# EAGLE design Elektroskate Teensy 20141205 (EAGLE 7.2.0)
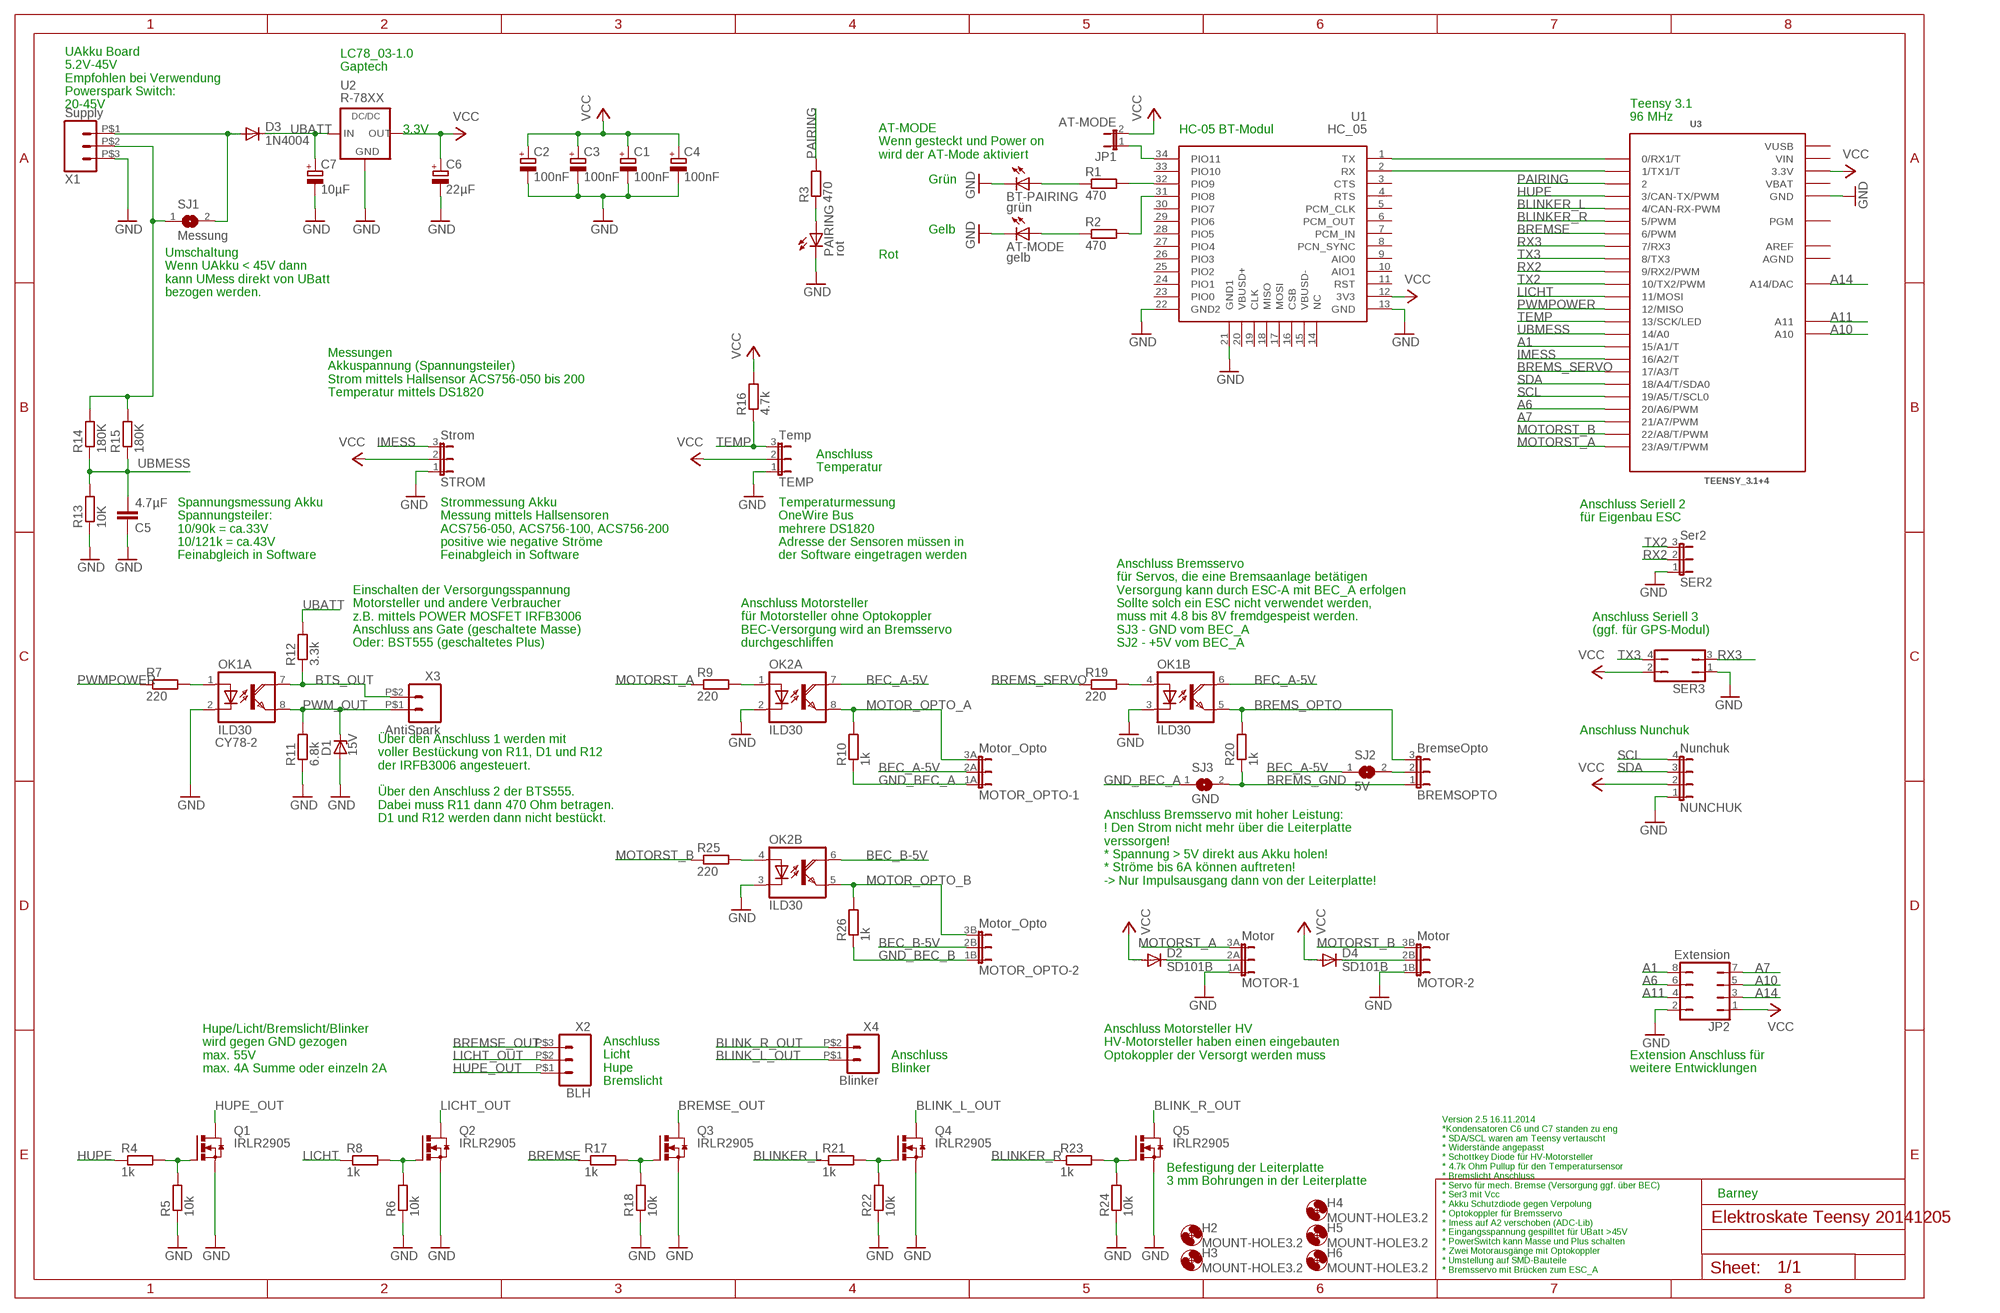
[diagram p0: schematic, sheet 1]

## Parts
AT-MODE  gelb  LEDSML0805  [SML0805]
BREMSOPTO  BremseOpto  JP2E  [JP2]
BT-PAIRING  grün  LEDSML0805  [SML0805]
C1  100nF  CPOL-EUB45181A  [B45181A]
C2  100nF  CPOL-EUB45181A  [B45181A]
C3  100nF  CPOL-EUB45181A  [B45181A]
C4  100nF  CPOL-EUB45181A  [B45181A]
C5  4.7µF  C-EUC1206  [C1206]
C6  22µF  CPOL-EUUD-4X5,8  [UD-4X5,8_NICHICON]
C7  10µF  CPOL-EUUD-6,3X8,8  [UD-6,3X5,8_NICHICON]
D1  15V  ZPD  [DO35Z10]
D2  SD101B  MBR0520LT  [SOD123]
D3  1N4004  [DO41-10]
D4  SD101B  MBR0520LT  [SOD123]
H2  MOUNT-HOLE3.2  [3,2]
H3  MOUNT-HOLE3.2  [3,2]
H4  MOUNT-HOLE3.2  [3,2]
H5  MOUNT-HOLE3.2  [3,2]
H6  MOUNT-HOLE3.2  [3,2]
JP1  AT-MODE  JP1E  [JP1]
JP2  Extension  JP4Q  [JP4Q]
MOTOR  Motor  JP3QE  [JP3Q]
MOTOR_OPTO  Motor_Opto  JP3QE  [JP3Q]
NUNCHUK  Nunchuk  JP4E  [JP4]
OK1  ILD30  [DIL08]
OK2  ILD30  [DIL08]
PAIRING  rot  LEDSML0805  [SML0805]
Q1  IRLR2905  [D-PAK_TO252AA]
Q2  IRLR2905  [D-PAK_TO252AA]
Q3  IRLR2905  [D-PAK_TO252AA]
Q4  IRLR2905  [D-PAK_TO252AA]
Q5  IRLR2905  [D-PAK_TO252AA]
R1  470  R-EU_R1206  [R1206]
R2  470  R-EU_R1206  [R1206]
R3  470  R-EU_R1206  [R1206]
R4  1k  R-EU_R1206  [R1206]
R5  10k  R-EU_R1206  [R1206]
R6  10k  R-EU_R1206  [R1206]
R7  220  R-EU_R1206  [R1206]
R8  1k  R-EU_R1206  [R1206]
R9  220  R-EU_R1206  [R1206]
R10  1k  R-EU_R1206  [R1206]
R11  6.8k  R-EU_R1206  [R1206]
R12  3.3k  R-EU_R1206  [R1206]
R13  10K  R-EU_R1206  [R1206]
R14  180K  R-EU_R1206  [R1206]
R15  180K  R-EU_R1206  [R1206]
R16  4.7k  R-EU_R1206  [R1206]
R17  1k  R-EU_R1206  [R1206]
R18  10k  R-EU_R1206  [R1206]
R19  220  R-EU_R1206  [R1206]
R20  1k  R-EU_R1206  [R1206]
R21  1k  R-EU_R1206  [R1206]
R22  10k  R-EU_R1206  [R1206]
R23  1k  R-EU_R1206  [R1206]
R24  10k  R-EU_R1206  [R1206]
R25  220  R-EU_R1206  [R1206]
R26  1k  R-EU_R1206  [R1206]
SER2  Ser2  JP2E  [JP2]
SER3  JP2Q  [JP2Q]
SJ1  Messung  SJ  [SJ]
SJ2  5V  SJ  [SJ]
SJ3  GND  SJ  [SJ]
STROM  Strom  JP2E  [JP2]
TEMP  Temp  JP2E  [JP2]
U1  HC_05  [BLUETOOTH_SMD]
U2  R-78XX  [R-78XX]
U3  TEENSY_3.1+4  [TEENSY_3.1+4]
X1  Supply  PSS254_3GEWINKELT  [03W]
X2  BLH  PSS254_3GEWINKELT  [03W]
X3  AntiSpark  PSS254_2GEWINKELT  [02W]
X4  Blinker  PSS254_2GEWINKELT  [02W]

## Nets
A1: JP2.8 U3.15/A1(15/A1/T)
A6: JP2.6 U3.20/A6(20/A6/PWM)
A7: JP2.7 U3.21/A7(21/A7/PWM)
A10: JP2.5 U3.A10
A11: JP2.4 U3.A11
A14: JP2.3 U3.A14(A14/DAC)
BEC_A-5V: MOTOR_OPTO.2A OK1.6(B:COL) OK2.7(A:COL) SJ2.1
BEC_B-5V: MOTOR_OPTO.2B OK2.6(B:COL)
BLINK_L_OUT: Q4.4(D) X4.P$1
BLINK_R_OUT [96mil]: Q5.4(D) X4.P$2
BLINKER_L: R21.1 U3.4(4/CAN-RX-PWM)
BLINKER_R: R23.1 U3.5(5/PWM)
BREMS_GND: BREMSOPTO.1 R20.1 SJ3.2
BREMS_OPTO: BREMSOPTO.3 OK1.5(B:EMI) R20.2
BREMS_SERVO: R19.1 U3.17/A3(17/A3/T)
BREMSE: R17.1 U3.6(6/PWM)
BREMSE_OUT: Q3.4(D) X2.P$3
BTS_OUT: OK1.7(A:COL) R12.1 X3.P$2
GND [24mil]: AT-MODE.C BT-PAIRING.C C1.- C2.- C3.- C4.- C5.1 C6.- C7.- D1.A JP2.2 MOTOR.1A MOTOR.1B NUNCHUK.1 OK1.2(A:C) OK1.3(B:C) OK2.2(A:C) OK2.3(B:C) PAIRING.C Q1.3(S) Q2.3(S) Q3.3(S) Q4.3(S) Q5.3(S) R5.1 R6.1 R11.1 R13.1 R18.1 R22.1 R24.1 SER2.1 SER3.1 STROM.1 TEMP.1 U1.13(GND) U1.21(GND1) U1.22(GND2) U2.2(GND) U3.GND U3.GND1(GND) X1.P$3
GND_BEC_A [24mil]: MOTOR_OPTO.1A R10.1 SJ3.1
GND_BEC_B: MOTOR_OPTO.1B R26.1
HUPE: R4.1 U3.3(3/CAN-TX/PWM)
HUPE_OUT: Q1.4(D) X2.P$1
IMESS: STROM.3 U3.16/A2(16/A2/T)
LICHT: R8.1 U3.11(11/MOSI)
LICHT_OUT: Q2.4(D) X2.P$2
MOTOR_OPTO_A: MOTOR_OPTO.3A OK2.8(A:EMI) R10.2
MOTOR_OPTO_B: MOTOR_OPTO.3B OK2.5(B:EMI) R26.2
MOTORST_A: MOTOR.3A R9.1 U3.23/A9(23/A9/T/PWM)
MOTORST_B: MOTOR.3B R25.1 U3.22/A8(22/A8/T/PWM)
N$1: U1.1(TX) U3.0(0/RX1/T)
N$2: U1.2(RX) U3.1(1/TX1/T)
N$3: BT-PAIRING.A R1.1
N$4: PAIRING.A R3.1
N$5: OK2.1(A:A) R9.2
N$6: R2.2 U1.31(PIO8)
N$7: AT-MODE.A R2.1
N$8: R1.2 U1.32(PIO9)
N$10: OK1.1(A:A) R7.2
N$11: D2.C MOTOR.2A
N$12: Q3.1(G) R17.2 R18.2
N$13 [48mil]: D3.A SJ1.2 X1.P$1
N$14: Q1.1(G) R4.2 R5.2
N$15: Q2.1(G) R6.2 R8.2
N$16: JP1.1 U1.34(PIO11)
N$17: OK1.4(B:A) R19.2
N$18: R14.2 R15.2 SJ1.1 X1.P$2
N$19: Q4.1(G) R21.2 R22.2
N$20: Q5.1(G) R23.2 R24.2
N$21: BREMSOPTO.2 SJ2.2
N$23: OK2.4(B:A) R25.2
N$24: D4.C MOTOR.2B
PAIRING: R3.2 U3.2
PWM_OUT: D1.C OK1.8(A:EMI) R11.2 X3.P$1
PWMPOWER: R7.1 U3.12(12/MISO)
RX2: SER2.2 U3.9(9/RX2/PWM)
RX3: SER3.3 U3.7(7/RX3)
SCL: NUNCHUK.4 U3.19/A5(19/A5/T/SCL0)
SDA: NUNCHUK.3 U3.18/A4(18/A4/T/SDA0)
TEMP: R16.1 TEMP.3 U3.13(13/SCK/LED)
TX2: SER2.3 U3.10(10/TX2/PWM)
TX3: SER3.4 U3.8(8/TX3)
UBATT [24mil]: C7.+ D3.C R12.2 U2.1(IN)
UBMESS: C5.2 R13.2 R14.1 R15.1 U3.14/A0
VCC [24mil]: C1.+ C2.+ C3.+ C4.+ C6.+ D2.A D4.A JP1.2 JP2.1 NUNCHUK.2 R16.2 SER3.2 STROM.2 TEMP.2 U1.12(3V3) U2.3(OUT) U3.3.3V U3.3.3V1(3.3V)
Unconnected: U1.3(CTS) U1.4(RTS) U1.5(PCM_CLK) U1.6(PCM_OUT) U1.7(PCM_IN) U1.8(PCN_SYNC) U1.9(AIO0) U1.10(AIO1) U1.11(RST) U1.14(NC) U1.15(VBUSD-) U1.16(CSB) U1.17(MOSI) U1.18(MISO) U1.19(CLK) U1.20(VBUSD+) U1.23(PIO0) U1.24(PIO1) U1.25(PIO2) U1.26(PIO3) U1.27(PIO4) U1.28(PIO5) U1.29(PIO6) U1.30(PIO7) U1.33(PIO10) U3.PGM

## Notes on the sheet
- LC78_03-1.0
  Gaptech
- UAkku Board
  5.2V-45V
  Empfohlen bei Verwendung
  Powerspark Switch:
  20-45V
- Teensy 3.1
  96 MHz
- HC-05 BT-Modul
- AT-MODE
  Wenn gesteckt und Power on
  wird der AT-Mode aktiviert
- Grün
- Gelb
- Rot
- Umschaltung
  Wenn UAkku < 45V dann 
  kann UMess direkt von UBatt 
  bezogen werden.
- Messungen
  Akkuspannung (Spannungsteiler)
  Strom mittels Hallsensor ACS756-050 bis 200
  Temperatur mittels DS1820
- Anschluss
  Temperatur
- Anschluss Seriell 2
  für Eigenbau ESC
- Spannungsmessung Akku
  Spannungsteiler:
  10/90k = ca.33V
  10/121k = ca.43V
  Feinabgleich in Software
- Strommessung Akku
  Messung mittels Hallsensoren
  ACS756-050, ACS756-100, ACS756-200  
  positive wie negative Ströme
  Feinabgleich in Software
- Temperaturmessung
  OneWire Bus
  mehrere DS1820
  Adresse der Sensoren müssen in
  der Software eingetragen werden
- Anschluss Seriell 3
  (ggf. für GPS-Modul)
- Einschalten der Versorgungsspannung
  Motorsteller und andere Verbraucher
  z.B. mittels POWER MOSFET IRFB3006
  Anschluss ans Gate (geschaltete Masse)
  Oder: BST555 (geschaltetes Plus)
- Anschluss Motorsteller
  für Motorsteller ohne Optokoppler
  BEC-Versorgung wird an Bremsservo
  durchgeschliffen
- Anschluss Bremsservo
  für Servos, die eine Bremsaanlage betätigen
  Versorgung kann durch ESC-A mit BEC_A erfolgen
  Sollte solch ein ESC nicht verwendet werden,
  muss mit 4.8 bis 8V fremdgespeist werden.
  SJ3 - GND vom BEC_A
  SJ2 - +5V vom BEC_A
- Anschluss Nunchuk
- Über den Anschluss 1 werden mit 
  voller Bestückung von R11, D1 und R12
  der IRFB3006 angesteuert.
  
  Über den Anschluss 2 der BTS555. 
  Dabei muss R11 dann 470 Ohm betragen. 
  D1 und R12 werden dann nicht bestückt.
- Anschluss Bremsservo mit hoher Leistung:
  ! Den Strom nicht mehr über die Leiterplatte
  verssorgen!
  * Spannung > 5V direkt aus Akku holen!
  * Ströme bis 6A können auftreten!
  -> Nur Impulsausgang dann von der Leiterplatte!
- Hupe/Licht/Bremslicht/Blinker
  wird gegen GND gezogen
  max. 55V
  max. 4A Summe oder einzeln 2A
- Anschluss 
  Blinker
- Anschluss Motorsteller HV
  HV-Motorsteller haben einen eingebauten
  Optokoppler der Versorgt werden muss
- Extension Anschluss für
  weitere Entwicklungen
- Anschluss 
  Licht
  Hupe
  Bremslicht
- Befestigung der Leiterplatte
  3 mm Bohrungen in der Leiterplatte
- Barney
- Version 2.5 16.11.2014
  *Kondensatoren C6 und C7 standen zu eng
  * SDA/SCL waren am Teensy vertauscht
  * Widerstände angepasst
  * Schottkey Diode für HV-Motorsteller
  * 4.7k Ohm Pullup für den Temperatursensor
  * Bremslicht Anschluss
  * Servo für mech. Bremse (Versorgung ggf. über BEC)
  * Ser3 mit Vcc
  * Akku Schutzdiode gegen Verpolung
  * Optokoppler für Bremsservo
  * Imess auf A2 verschoben (ADC-Lib)
  * Eingangsspannung gespilltet für UBatt >45V
  * PowerSwitch kann Masse und Plus schalten
  * Zwei Motorausgänge mit Optokoppler
  * Umstellung auf SMD-Bauteile
  * Bremsservo mit Brücken zum ESC_A

## Power pins joined to a net without a drawn wire
AGND: U3.AGND
AREF: U3.AREF
VBAT: U3.VBAT
VIN: U3.VIN
VUSB: U3.VUSB

## Library data of the parts
AT-MODE BT-PAIRING PAIRING = led:LED: LED OSRAM: - CHIPLED LG R971, LG N971, LY N971, LG Q971, LY Q971, LO R971, LY R971 LH N974, LH R974 LS Q976, LO Q976, LY Q976 LO Q996 - Hyper CHIPLED LW Q18S LB Q993, LB Q99A, LB R99A - SideLED LS A670, LO A670, LY A670, LG A670, LP A670 LB A673, LV A673, LT A673, LW A673 LH A674 LY A675 LS A676, LA A676, LO A676, LY A676, LW A676 LS A679, LY A679, LG A679 - Hyper Micro SIDELED® LS Y876, LA Y876, LO Y876, LY Y876 LT Y87S - SmartLED LW L88C, LW L88S LB L89C, LB L89S, LG L890 LS L89K, LO L89K, LY L89K LS L896, LA L896, LO L896, LY L896 - TOPLED LS T670, LO T670, LY T670, LG T670, LP T670 LSG T670, LSP T670, LSY T670, LOP T670, LYG T670 LG T671, LOG T671, LSG T671 LB T673, LV T673, LT T673, LW T673 LH T674 LS T676, LA T676, LO T676, LY T676, LB T676, LH T676, LSB T676, LW T676 LB T67C, LV T67C, LT T67C, LS T67K, LO T67K, LY T67K, LW E67C LS E67B, LA E67B, LO E67B, LY E67B, LB E67C, LV E67C, LT E67C LW T67C LS T679, LY T679, LG T679 LS T770, LO T770, LY T770, LG T770, LP T770 LB T773, LV T773, LT T773, LW T773 LH T774 LS E675, LA E675, LY E675, LS T675 LS T776, LA T776, LO T776, LY T776, LB T776 LHGB T686 LT T68C, LB T68C - Hyper Mini TOPLED® LB M676 - Mini TOPLED Santana® LG M470 LS M47K, LO M47K, LY M47K Source: http://www.osram.convergy.de LUXEON: - LUMILED® LXK2-PW12-R00, LXK2-PW12-S00, LXK2-PW14-U00, LXK2-PW14-V00 LXK2-PM12-R00, LXK2-PM12-S00, LXK2-PM14-U00 LXK2-PE12-Q00, LXK2-PE12-R00, LXK2-PE12-S00, LXK2-PE14-T00, LXK2-PE14-U00 LXK2-PB12-K00, LXK2-PB12-L00, LXK2-PB12-M00, LXK2-PB14-N00, LXK2-PB14-P00, LXK2-PB14-Q00 LXK2-PR12-L00, LXK2-PR12-M00, LXK2-PR14-Q00, LXK2-PR14-R00 LXK2-PD12-Q00, LXK2-PD12-R00, LXK2-PD12-S00 LXK2-PH12-R00, LXK2-PH12-S00 LXK2-PL12-P00, LXK2-PL12-Q00, LXK2-PL12-R00 Source: www.luxeon.com KINGBRIGHT: KA-3528ASYC Source: www.kingbright.com
BREMSOPTO SER2 STROM TEMP = jumper:JP2E: JUMPER
C1-C4 C6 C7 = rcl:CPOL-EU: POLARIZED CAPACITOR, European symbol
C5 = rcl:C-EU: CAPACITOR, European symbol
D1 = diode:ZPD: Z DIODE 500 mW
D2 D4 = diode:MBR0520LT: SCHOTTKY BARRIER RECTIFIER Source: http://onsemi.com .. MBR0520LT1-D.pdf
D3 = diode:1N4004: DIODE general purpose rectifier, 1 A
H2-H6 = holes:MOUNT-HOLE: MOUNTING HOLE with drill center marker
JP1 = jumper:JP1E: JUMPER
JP2 = jumper:JP4Q: JUMPER
MOTOR MOTOR_OPTO = connector:JP3QE: JUMPER
NUNCHUK = jumper:JP4E: JUMPER
OK1 OK2 = optocoupler:ILD30: SIEMENS OPTO COUPLER; MF: VISHAY/TELEFUNKEN; MPN: ILD30; OC_FARNELL: 1612448; OC_NEWARK: 58K1668
Q1-Q5 = International Rectifier:IRLR2905: SMPS MOSFET HEXFET® Power MOSFET Source: http://www.irf.com/product-info/datasheets/data/irf3704.pdf
R1-R26 = rcl:R-EU_: RESISTOR, European symbol
SER3 = jumper:JP2Q: JUMPER
SJ1-SJ3 = jumper:SJ: SMD solder JUMPER
U1 = Bluetooth HC-05:HC_05: HC-05 Bluetooth Module
U2 = recom-intl:R-78XX: DC-DC CONVERTER R-78xx-0.5 Series; LC78_03-10: Gaptech; SPANNUNG: 3.3V
U3 = Teensy_3_Series_Board_v1.0:TEENSY_3.1+4: Footprint for Teensy 3.1 board using all through-holes, i.e. the entire perimeter plus the 4 through-holes inboard (A10,A11,AREF, VUSB)
X1 X2 = con-pss254_reichelt:PSS254_3
X3 X4 = con-pss254_reichelt:PSS254_2

## Net classes
0 default: width 0.305 mm, clearance 0.205 mm
1 24mil: width 0.61 mm, clearance 0.205 mm to class 0, clearance 0.205 mm
2 48mil: width 1.219 mm, clearance 0.205 mm to class 0, clearance 0.205 mm to class 1, clearance 0.205 mm
3 96mil: width 2.438 mm

## Board
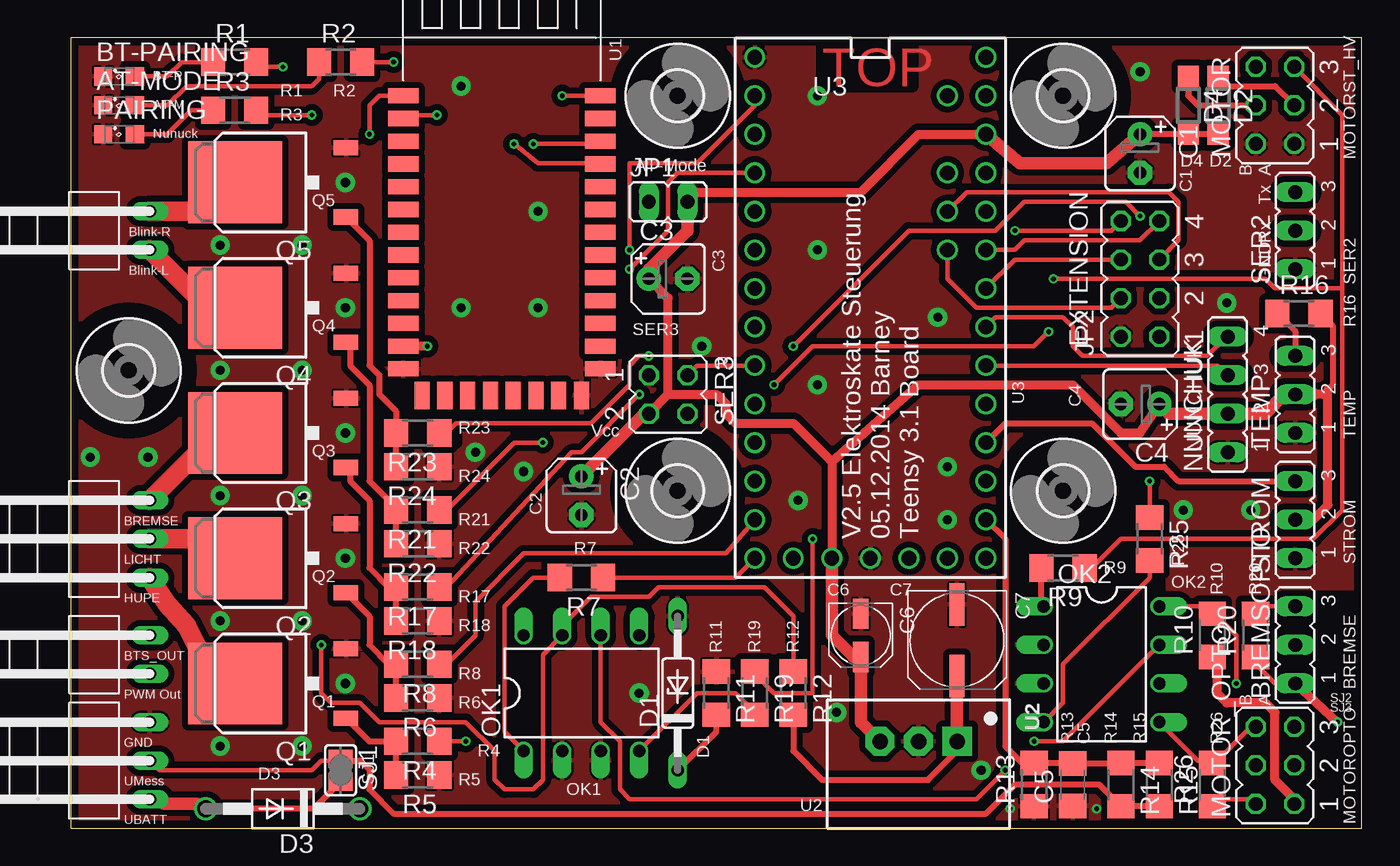
[diagram p1: board, top side]
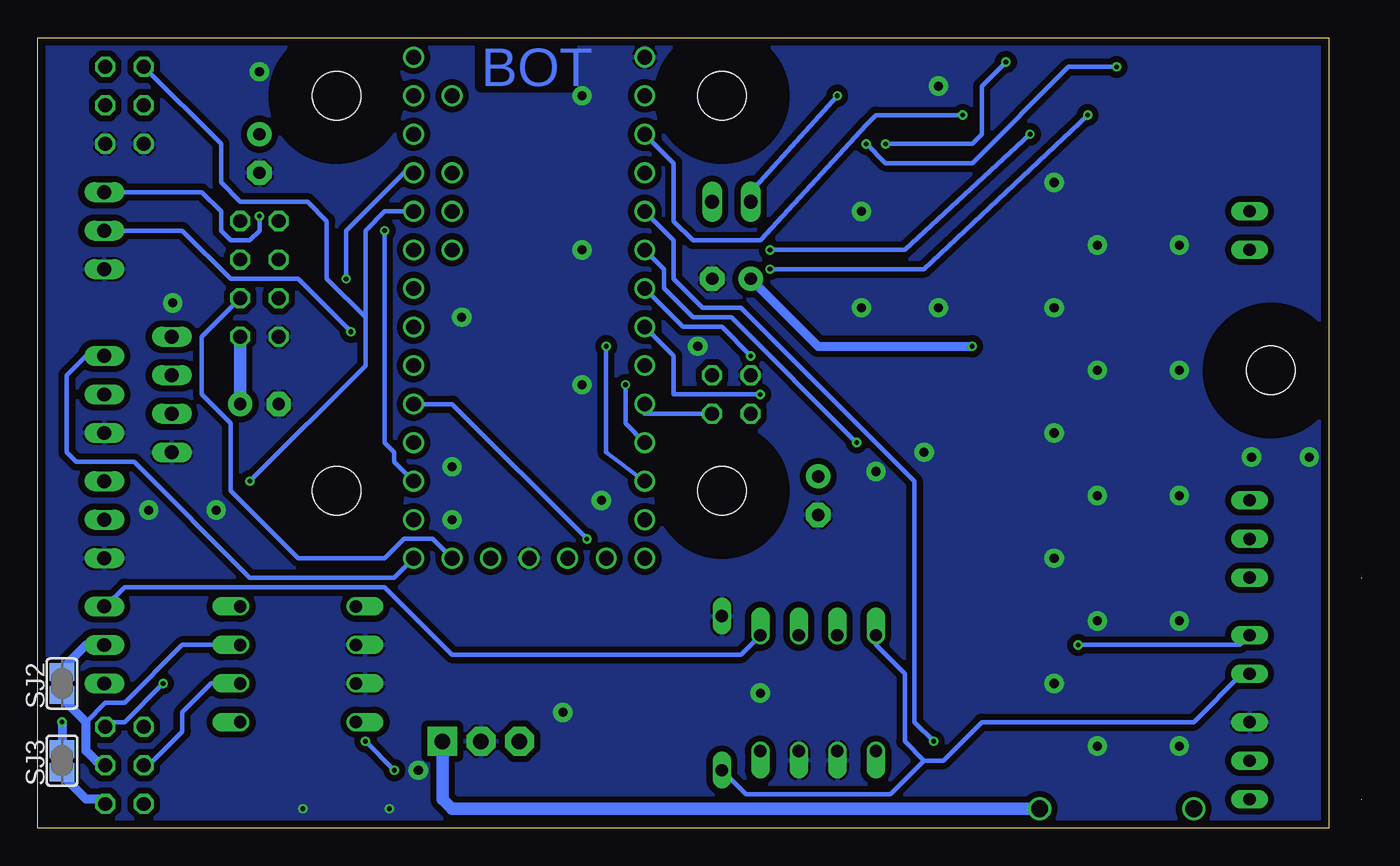
[diagram p2: board, bottom side, seen from below]

Size 85.09 x 52.07 mm. Coordinates in mm from the lower left corner, seen from the top.
Outline: 0,0 85.09,0 85.09,52.07 0,52.07 0,0
Copper layers (1*16): Top 0.035mm / dielectric 1.5mm / Bottom 0.035mm
Design rules "multi-cb_035um-cu-Fischer-Leiterplatten 20141223": minimum track width 6mil, minimum drill 12mil, track to track 6mil, track to pad 6mil, pad to pad 6mil, via to via 6mil, smd to smd 6mil, copper to edge 20mil, drill to drill 8mil, minimum pad ring 8mil, minimum via ring 6mil, stop-mask expansion 6mil, vias tented up to drill 0mil, thermal gap 6mil
tRestrict: area 81.9,-0.6 to 85.1,15.2; area 20.3,25.4 to 25.4,29.2; area 62.9,5.1 to 71.8,18.4

### Footprints (pad centres in the part's own frame; a part is rotated, then mirrored left to right if it is on the bottom)
SML0805 = smd 1.2 x 1.2: A 1.05,0; C -1.05,0
JP2 = drill 0.914 long: 1 -2.54,0; 2 0,0; 3 2.54,0
B45181A = drill 0.813 pad 1.6: + -1.27,0 | drill 0.813 pad 1.6 octagon: - 1.27,0
C1206 = smd 1.6 x 1.8: 1 -1.4,0; 2 1.4,0
UD-4X5,8_NICHICON = smd 2 x 1: + 1.425,0; - -1.425,0
UD-6,3X5,8_NICHICON = smd 2.8 x 1: + 2.35,0; - -2.35,0
DO35Z10 = drill 0.813 long: A 5.08,0; C -5.08,0
SOD123 = smd 1.4 x 1.4: A 1.9,0; C -1.9,0
DO41-10 = drill 1.118: A 5.08,0; C -5.08,0
3,2 = hole 3.2: 0,0
JP1 = drill 0.914 long: 1 0,-1.27; 2 0,1.27
JP4Q = drill 0.914 octagon: 1 -3.81,-1.27; 2 -3.81,1.27; 3 -1.27,-1.27; 4 -1.27,1.27; 5 1.27,-1.27; 6 1.27,1.27; 7 3.81,-1.27; 8 3.81,1.27
JP3Q = drill 0.914 octagon: 1A -2.54,-1.27; 1B -2.54,1.27; 2A 0,-1.27; 2B 0,1.27; 3A 2.54,-1.27; 3B 2.54,1.27
JP4 = drill 0.914 long: 1 -3.81,0; 2 -1.27,0; 3 1.27,0; 4 3.81,0
DIL08 = drill 0.813 offset: 1 -3.81,-3.81; 2 -1.27,-3.81; 3 1.27,-3.81; 4 3.81,-3.81; 5 3.81,3.81; 6 1.27,3.81; 7 -1.27,3.81; 8 -3.81,3.81
D-PAK_TO252AA = smd 1 x 1.6: 1 -2.28,-4.8; 3 2.28,-4.8 | smd 5.4 x 6.2: 4 0,2.5
R1206 = smd 1.6 x 1.803: 1 -1.422,0; 2 1.422,0
JP2Q = drill 0.914 octagon: 1 -1.27,-1.27; 2 1.27,-1.27; 3 -1.27,1.27; 4 1.27,1.27
SJ = smd 1.168 x 1.6: 1 -0.762,0; 2 0.762,0
BLUETOOTH_SMD = smd 2 x 1: 1 -6.35,3.81; 2 -6.35,2.31; 3 -6.35,0.81; 4 -6.35,-0.69; 5 -6.35,-2.19; 6 -6.35,-3.69; 7 -6.35,-5.19; 8 -6.35,-6.69; 9 -6.35,-8.19; 10 -6.35,-9.69; 11 -6.35,-11.19; 12 -6.35,-12.69; 13 -6.35,-14.19; 22 6.65,-14.19; 23 6.65,-12.69; 24 6.65,-11.19; 25 6.65,-9.69; 26 6.65,-8.19; 27 6.65,-6.69; 28 6.65,-5.19; 29 6.65,-3.69; 30 6.65,-2.19; 31 6.65,-0.69; 32 6.65,0.81; 33 6.65,2.31; 34 6.65,3.81 | smd 1 x 1.8: 14 -5.1,-15.94; 15 -3.6,-15.94; 16 -2.1,-15.94; 17 -0.6,-15.94; 18 0.9,-15.94; 19 2.4,-15.94; 20 3.9,-15.94; 21 5.4,-15.94
R-78XX = drill 1.016 pad 1.93 square: 1 -2.54,0 | drill 1.016 pad 1.93 octagon: 2 0,0; 3 2.54,0
TEENSY_3.1+4 = drill 0.965: 0 -7.62,15.24; 1 -7.62,12.7; 2 -7.62,10.16; 3 -7.62,7.62; 3.3V 7.62,12.7; 3.3V1 -2.54,-15.24; 4 -7.62,5.08; 5 -7.62,2.54; 6 -7.62,0; 7 -7.62,-2.54; 8 -7.62,-5.08; 9 -7.62,-7.62; 10 -7.62,-10.16; 11 -7.62,-12.7; 12 -7.62,-15.24; 13 7.62,-15.24; 14/A0 7.62,-12.7; 15/A1 7.62,-10.16; 16/A2 7.62,-7.62; 17/A3 7.62,-5.08; 18/A4 7.62,-2.54; 19/A5 7.62,0; 20/A6 7.62,2.54; 21/A7 7.62,5.08; 22/A8 7.62,7.62; 23/A9 7.62,10.16; A10 5.08,7.62; A11 5.08,5.08; A14 5.08,-15.24; AGND 7.62,15.24; AREF 5.08,10.16; GND -7.62,17.78; GND1 0,-15.24; PGM 2.54,-15.24; VBAT -5.08,-15.24; VIN 7.62,17.78; VUSB 5.08,15.24
03W = drill 0.8 long: P$1 1.27,-2.032; P$2 3.81,-2.032; P$3 6.35,-2.032
02W = drill 0.8 long: P$1 1.27,-2.032; P$2 3.81,-2.032

### Placement (x,y rotation side)
AT-MODE  3.17,47.62 0 top
BREMSOPTO  80.71,12.06 90 top
BT-PAIRING  3.17,49.53 0 top
C1  70.48,44.45 270 top
C2  33.66,21.91 270 top
C3  39.37,36.2 0 top
C4  70.48,27.94 180 top
C5  66.04,2.86 90 top
C6  52.07,12.7 270 top
C7  58.42,12.38 270 top
D1  40.01,8.89 90 top
D2  75.63,47.62 270 top
D3  13.97,1.27 180 top
D4  73.66,47.62 270 top
H2  40.01,48.26 0 top
H3  3.81,30.16 0 top
H4  65.41,22.23 0 top
H5  40.01,22.23 0 top
H6  65.41,48.26 0 top
JP1  39.37,41.27 270 top
JP2  70.48,36.2 90 top
MOTOR  79.38,47.62 90 top
MOTOR_OPTO  79.38,4.13 90 top
NUNCHUK  76.26,28.57 90 top
OK1  33.66,8.89 0 top
OK2  67.94,10.79 270 top
PAIRING  3.17,45.72 0 top
Q1  13.34,9.53 90 top
Q2  13.34,17.78 90 top
Q3  13.34,26.04 90 top
Q4  13.34,34.29 90 top
Q5  13.34,42.55 90 top
R1  10.79,50.48 0 top
R2  17.78,50.48 0 top
R3  10.79,47.31 0 top
R4  22.86,5.71 180 top
R5  22.86,3.49 180 top
R6  22.86,8.57 180 top
R7  33.66,16.51 180 top
R8  22.86,10.79 180 top
R9  65.41,17.14 180 top
R10  75.25,12.7 90 top
R11  42.55,8.89 270 top
R12  47.62,8.89 270 top
R13  63.5,2.86 90 top
R14  69.22,2.86 270 top
R15  71.75,2.86 270 top
R16  80.96,33.91 0 top
R17  22.86,15.88 180 top
R18  22.86,13.65 180 top
R19  45.09,8.89 270 top
R20  78.11,12.7 90 top
R21  22.86,20.95 180 top
R22  22.86,18.73 180 top
R23  22.86,26.04 180 top
R24  22.86,23.81 180 top
R25  71.12,19.05 270 top
R26  75.25,2.86 90 top
SER2  80.71,39.37 90 top
SER3  39.37,28.57 270 top
SJ1  17.78,3.81 270 top
SJ2  83.5,9.53 90 bottom
SJ3  83.5,4.45 90 bottom
STROM  80.71,20.32 90 top
TEMP  80.71,28.57 90 top
U1  28.26,44.45 0 top
U2  55.88,5.71 180 top
U3  52.7,33.02 0 top
X1  3.17,0.64 90 top
X2  3.17,15.24 90 top
X3  3.17,8.89 90 top
X4  3.17,36.83 90 top

### Tracks (layer width: path | path; a pad name or v marks a point on that pad's centre or on a via)
A1  (via drill 0.3)
  Top 0.305: JP2.8 68.58,39.37 v62.23,39.37
  Bottom 0.305: v62.23,39.37 62.23,25.4 61.59,24.77 61.59,24.13 U3.15/A1
A6
  Top 0.305: JP2.6 62.23,37.47 U3.20/A6
A7
  Top 0.305: JP2.7 70.48,38.73 62.87,38.73 62.23,38.1 U3.21/A7
A10
  Top 0.305: JP2.5 73.03,38.73 73.03,41.27 72.39,41.91 59.05,41.91 U3.A10
A11
  Top 0.305: JP2.4 68.58,34.29 59.69,34.29 57.78,36.2 U3.A11
A14
  Bottom 0.305: JP2.3 74.3,32.38 74.3,28.57 72.39,26.67 72.39,22.23 67.94,17.78 62.23,17.78 60.96,19.05 59.05,19.05 U3.A14
BEC_A-5V  (via drill 0.3)
  Top 0.305: OK1.6 34.92,6.99 36.2,5.71 36.2,2.54 36.83,1.91 59.69,1.91 v61.59,3.81 | v63.5,5.71 65.41,5.71 OK2.7
  Bottom 0.305: 83.19,8.26 SJ2.1 | 80.64,3.81 MOTOR_OPTO.2A | 81.92,6.99 80.64,8.26 79.38,8.26 75.56,12.06 OK2.7 | v61.59,3.81 v63.5,5.71
  Bottom 0.61: 83.19,8.26 81.92,6.99 81.92,5.08 80.64,3.81
BEC_B-5V
  Bottom 0.305: OK2.6 73.66,9.53 75.56,7.62 75.56,6.35 78.11,3.81 MOTOR_OPTO.2B
BLINK_L_OUT
  Top 1.27: X4.P$1 9.02,34.29 Q4.4
BLINK_R_OUT
  Top 1.27: X4.P$2 9.53,40.64 10.84,41.95 Q5.4
BLINKER_L  (via drill 0.3)
  Top 0.305: v31.11,25.4 29.21,25.4 24.77,20.95 R21.1
  Bottom 0.305: v31.11,25.4 39.37,33.66 41.91,33.66 43.81,35.56 43.81,36.83 U3.4
BLINKER_R  (via drill 0.3)
  Top 0.305: v38.1,31.11 37.47,31.11 36.83,30.48 36.83,29.21 34.29,26.67 25.4,26.67 24.77,26.04 R23.1
  Bottom 0.305: v38.1,31.11 40.01,33.02 42.55,33.02 U3.5
BREMS_GND  (via drill 0.3)
  Top 0.305: BREMSOPTO.1 79.38,9.53 78.11,10.79 R20.1
  Top 0.61: BREMSOPTO.1 v83.5,6.99
  Bottom 0.61: v83.5,6.99 SJ3.2
BREMS_OPTO
  Top 0.305: BREMSOPTO.3 78.11,14.61 R20.2
  Bottom 0.305: OK1.5 38.73,11.43 57.78,11.43 62.23,15.88 79.38,15.88 80.64,14.61 BREMSOPTO.3
BREMS_SERVO  (via drill 0.3)
  Top 0.305: v48.9,19.05 48.9,8.89 46.35,8.89 45.09,10.16 R19.1
  Bottom 0.305: v48.9,19.05 57.78,27.94 U3.17/A3
BREMSE  (via drill 0.3)
  Top 0.305: v37.47,28.57 33.66,24.77 33.02,24.77 24.77,15.88 R17.1
  Bottom 0.305: v37.47,28.57 43.18,28.57 43.18,31.11 U3.6
BREMSE_OUT
  Top 1.27: X2.P$3 9.65,26.04 Q3.4
BTS_OUT  (via drill 0.3)
  Top 0.305: 47.62,10.79 R12.1 47.62,13.97 45.72,15.88 38.73,15.88 38.1,15.24 34.29,15.24 32.38,13.34 OK1.7 31.11,11.43 31.11,3.17 30.48,2.54 28.57,2.54 27.94,3.17 27.94,5.08 26.04,6.99 20.32,6.99 19.05,8.26 17.14,8.26 16.51,8.89 v16.51,12.06
  Bottom 0.305: v16.51,12.06 5.84,12.06 X3.P$2
GND  (via drill 0.3, 0.6 pad 1.27)
  other vias: 18.1,9.53 15.24,21.91 9.84,21.91 18.1,17.78 18.1,26.04 15.24,30.16 9.84,30.16 15.24,38.42 9.84,38.42 18.1,42.55 18.1,34.29 25.72,34.29 30.8,34.29 49.21,48.26 73.34,20.95 50.48,7.62 9.84,5.4 15.24,5.4 9.84,13.65 15.24,13.65 37.47,8.89 29.84,23.5 1.27,24.45 5.08,24.45 77.79,20.95 41.59,31.75 26.67,24.77 76.2,34.61 49.21,38.1 49.21,29.21 47.94,21.59 57.15,33.66 57.78,23.81 25.72,48.9 30.8,40.64 70.48,49.85 61.91,1.27 67.63,1.27 60.01,3.81 57.78,20.32
  pour Top (isolate 0.406, rank 2): 0,0 0,52.07 85.22,52.07 85.22,0
  pour Bottom (isolate 0.406, rank 2): 0,0 0,52.07 85.22,52.07 85.22,0
GND_BEC_A
  Top 0.61: R10.1 75.56,10.79 75.56,8.89 76.2,8.26 78.74,8.26 79.38,7.62 79.38,3.17 80.64,1.91 MOTOR_OPTO.1A
  Bottom 0.61: SJ3.1 83.19,3.17 81.92,1.91 80.64,1.91 MOTOR_OPTO.1A
GND_BEC_B
  Top 0.305: R26.1 75.56,1.91 78.11,1.91 MOTOR_OPTO.1B
HUPE  (via drill 0.3)
  Top 0.305: v26.04,5.71 R4.1
  Bottom 0.305: v26.04,5.71 27.3,6.99 27.3,22.86 38.73,34.29 41.27,34.29 43.18,36.2 43.18,38.73 U3.3
HUPE_OUT
  Top 1.27: X2.P$1 6.35,14.73 7.62,13.34 9.53,9.53 Q1.4
IMESS
  Top 0.406: U3.16/A2 61.59,26.67 67.31,26.67 70.17,23.81 72.07,23.81 73.03,22.86 STROM.3
LICHT
  Top 0.305: U3.11 43.18,18.1 29.84,18.1 26.67,14.92 26.67,12.7 24.77,10.79 R8.1
LICHT_OUT
  Top 1.27: X2.P$2 10.29,19.05 10.79,18.41 10.84,18.38 Q2.4
MOTOR_OPTO_A  (via drill 0.3)
  Top 0.305: OK2.8 74.93,14.61 R10.2 75.56,13.97 76.83,12.7 v76.83,9.53
  Bottom 0.305: v76.83,9.53 79.38,6.99 80.64,6.99 MOTOR_OPTO.3A
MOTOR_OPTO_B
  Top 0.305: MOTOR_OPTO.3B 78.11,6.35 77.47,6.35 75.56,4.45 R26.2 74.93,4.45 74.3,4.45 OK2.5
MOTORST_A  (via drill 0.3)
  Top 0.305: 83.82,35.56 83.82,46.99 MOTOR.3A | 83.82,35.56 83.82,20.95 81.92,19.05 69.22,19.05 67.31,17.14 R9.1 | v64.77,36.2 78.74,36.2 79.38,35.56 83.82,35.56
  Bottom 0.305: U3.23/A9 60.96,43.18 64.77,39.37 v64.77,36.2
MOTORST_B  (via drill 0.3)
  Top 0.305: v71.12,22.86 R25.1
  Bottom 0.305: v71.12,22.86 63.5,30.48 63.5,33.66 | 63.5,33.66 63.5,39.37 62.23,40.64 U3.22/A8 | MOTOR.3B 73.03,45.09 73.03,42.55 71.75,41.27 67.31,41.27 66.04,40.01 66.04,36.2 63.5,33.66
N$1  (via drill 0.3)
  Top 0.305: U1.1 20.32,48.26 19.68,47.62 v19.68,45.72 | v36.83,38.1 36.83,43.81 41.27,43.81 45.09,47.62 U3.0
  Bottom 0.305: v19.68,45.72 27.94,38.1 v36.83,38.1
N$2  (via drill 0.3)
  Top 0.305: v24.13,46.99 22.23,46.99 U1.2
  Bottom 0.305: v24.13,46.99 29.84,46.99 30.48,46.35 37.47,38.73 41.91,38.73 43.18,40.01 43.18,43.81 U3.1
N$3
  Top 0.305: BT-PAIRING.A 6.35,49.53 7.3,50.48 R1.1
N$4
  Top 0.305: PAIRING.A 6.35,45.72 7.94,47.31 R3.1
N$5
  Top 0.406: OK2.1 63.98,14.76 R9.2
N$6  (via drill 0.3)
  Top 0.305: v21.27,50.48 R2.2 | v29.21,45.09 30.8,43.81 34.29,43.81 U1.31
  Bottom 0.305: v29.21,45.09 23.5,45.09 22.86,45.72 22.86,48.9 v21.27,50.48
N$7
  Top 0.305: AT-MODE.A 6.35,47.62 7.62,48.9 15.88,48.9 16.36,49.38 R2.1
N$8  (via drill 0.3)
  Top 0.305: v30.48,45.09 34.29,45.09 U1.32 | v13.97,50.16 12.7,50.16 R1.2
  Bottom 0.305: v13.97,50.16 17.14,50.16 23.5,43.81 29.21,43.81 v30.48,45.09
N$10
  Top 0.305: OK1.1 28.57,6.35 28.57,14.61 30.48,16.51 R7.2
N$11
  Top 0.406: D2.C 76.26,48.9 79.38,48.9 MOTOR.2A
N$12
  Top 0.406: R18.2 R17.2 20.95,15.88 19.68,17.14 19.68,21.57 18.41,22.86 18.41,23.75 Q3.1
N$13
  Top 0.406: SJ1.2 16,1.27 D3.A
  Top 0.813: X1.P$1 6.16,1.59 8.26,1.59 D3.A
N$14
  Top 0.406: Q1.1 19.66,5.71 R4.2 R5.2
N$15
  Top 0.406: R6.2 R8.2 20.95,10.79 19.68,12.06 19.68,13.95 Q2.1
N$16  (via drill 0.3)
  Top 0.305: v32.38,48.26 U1.34
  Bottom 0.305: v32.38,48.26 38.1,41.91 JP1.1
N$17
  Top 0.305: OK1.4 41.27,8.89 43.81,8.89 45.09,7.62 R19.2
N$18
  Top 0.305: X1.P$2 5.84,3.81 15.88,3.81 16.51,4.45 17.65,4.45 SJ1.1
  Top 0.406: R15.2 R14.2 67.79,2.86 62.23,2.86 60.33,0.95 21.27,0.95 19.68,2.54 19.68,3.81 19.05,4.45 17.91,4.45 SJ1.1
N$19
  Top 0.406: R22.2 R21.2 21.44,21.11 19.68,22.86 19.68,29.19 18.41,30.48 18.41,32.01 Q4.1
N$20
  Top 0.406: R24.2 R23.2 21.44,27.46 20.32,28.57 20.32,29.84 19.68,30.48 19.68,38.72 Q5.1
N$21
  Bottom 0.305: 83.19,10.79 SJ2.2
  Bottom 0.61: 83.19,10.79 81.92,12.06 BREMSOPTO.2
N$23
  Top 0.305: R25.2 71.12,16.51 65.41,10.79 65.41,8.26 OK2.4
N$24
  Top 0.406: D4.C 73.66,48.26 74.3,47.62 MOTOR.2B
PAIRING  (via drill 0.3)
  Top 0.305: v15.88,46.99 12.7,46.99 R3.2 | v36.83,36.83 39.37,39.37 39.37,42.55 40.01,43.18 U3.2
  Bottom 0.305: v15.88,46.99 26.67,36.83 v36.83,36.83
PWM_OUT
  Top 0.406: D1.C 42.55,6.35 R11.2
  Bottom 0.305: 26.67,4.45 27.94,5.71 27.94,10.16 29.84,12.06 OK1.8 | 26.67,4.45 25.4,4.45 22.86,6.99 8.89,6.99 5.71,10.16 X3.P$1 | D1.C 38.42,2.22 28.89,2.22 26.67,4.45
PWMPOWER
  Top 0.305: R7.1 43.81,16.51 U3.12
RX2  (via drill 0.3)
  Top 0.305: v64.45,32.7 63.5,31.75 48.9,31.75 v46.35,29.21
  Bottom 0.305: v64.45,32.7 67.94,36.2 72.39,36.2 75.56,39.37 SER2.2 | v46.35,29.21 46.35,26.67 U3.9
RX3
  Top 0.305: SER3.3 41.27,30.48 U3.7
SCL
  Top 0.305: U3.19/A5 60.96,33.66 65.41,33.66 66.04,33.02 66.04,31.75 66.67,31.11 74.93,31.11 76.2,32.38 NUNCHUK.4
SDA
  Top 0.305: U3.18/A4 75.56,30.48 76.2,29.84 NUNCHUK.3
TEMP
  Top 0.406: R16.1 80.71,32.74 TEMP.3
  Bottom 0.305: U3.13 61.59,16.51 71.12,16.51 78.74,24.13 82.55,24.13 83.19,24.77 83.19,29.84 81.92,31.11 TEMP.3
TX2  (via drill 0.3)
  Top 0.305: v70.48,40.32 69.53,41.27 62.87,41.27 60.96,39.37 55.24,39.37 v47.62,31.75
  Bottom 0.305: SER2.3 74.3,41.91 73.03,40.64 73.03,39.37 72.39,38.73 71.12,38.73 70.48,39.37 v70.48,40.32 | v47.62,31.75 47.62,24.77 U3.10
TX3
  Bottom 0.305: SER3.4 45.09,27.3 U3.8
UBATT
  Top 0.406: R12.2 47.62,5.08 49.53,3.17 56.52,3.17 58.42,5.08 U2.1
  Top 0.813: C7.+ U2.1
  Bottom 0.813: U2.1 58.42,1.91 57.78,1.27 D3.C
UBMESS
  Top 0.406: R15.1 R14.1 69.22,4.26 C5.2 65.89,4.28 R13.2 62.71,4.28 61.59,5.4 61.59,19.05 U3.14/A0
VCC  (via drill 0.3)
  Top 0.406: R16.2 83.19,33.11 83.19,29.21 82.87,28.89 82.55,28.57 | D2.A D4.A C1.+
  Top 0.61: 82.55,28.57 81.92,28.57 | JP1.2 41.27,41.91 52.07,41.91 55.88,45.72 U3.3.3V | SER3.2 39.37,28.57 | 39.37,28.57 39.37,34.92 C3.+ | 39.37,28.57 42.55,28.57 43.18,27.94 43.18,27.3 43.81,26.67 47.62,26.67 50.16,24.13 | 50.16,24.13 U3.3.3V1 | C4.+ 70.48,26.04 69.22,26.04 66.04,29.21 55.88,29.21 50.16,24.13 | v23.5,31.75 22.23,31.75 U1.12 | STROM.2 81.92,20.32 82.87,21.27 82.87,28.89
  Top 0.813: U2.3 52.07,6.99 C6.+ 51.59,11.28 50.16,12.7 U3.3.3V1 | C4.+ 72.39,27.3 NUNCHUK.2 78.74,27.3 80.01,28.57 TEMP.2 81.92,28.57 | C1.+ 68.26,43.81 62.55,43.81 U3.3.3V | JP1.2 40.64,39.37 38.1,36.83 C3.+ | C2.+ 37.78,27.3 SER3.2
  Bottom 0.61: C3.+ 33.66,31.75 v23.5,31.75
  Bottom 0.813: JP2.1 C4.+

### Text on the board
Top: TOP
Bottom: BOT
_tNames: U1 | BT-P | R1 | R2 | AT-M | R3 | Nunuck | AT-Mode | D4 | D2 | MOTORST_HV | B | A | C1 | Q5 | Tx | Blink-R | Rx | C3 | Blink-L | GND | SER2 | Q4 | SER3 | R16 | EXTENSION | R | C4 | U3 | T | R23 | Vcc | TEMP | NUNCHUK | Q3 | R24 | C2 | BREMSE | R21 | V2.5 Elektroskate Steuerung / 05.12.2014 Barney / Teensy 3.1 Board | R22 | R7 | LICHT | R9 | R25 | STROM | Q2 | OK2 | HUPE | R17 | C6 | C7 | R10 | R20 | R18 | R11 | R19 | R12 | BTS_OUT | R8 | PWM Out | SJ2 | BREMSE | Q1 | R6 | B | A | SJ3 | D1 | R13 | C5 | R14 | R15 | R26 | GND | R4 | UMess | D3 | SJ1 | R5 | OK1 | U2 | UBATT | MOTOROPTO